# EAGLE schematic pic10_prog_breakout (EAGLE 7.5.0)
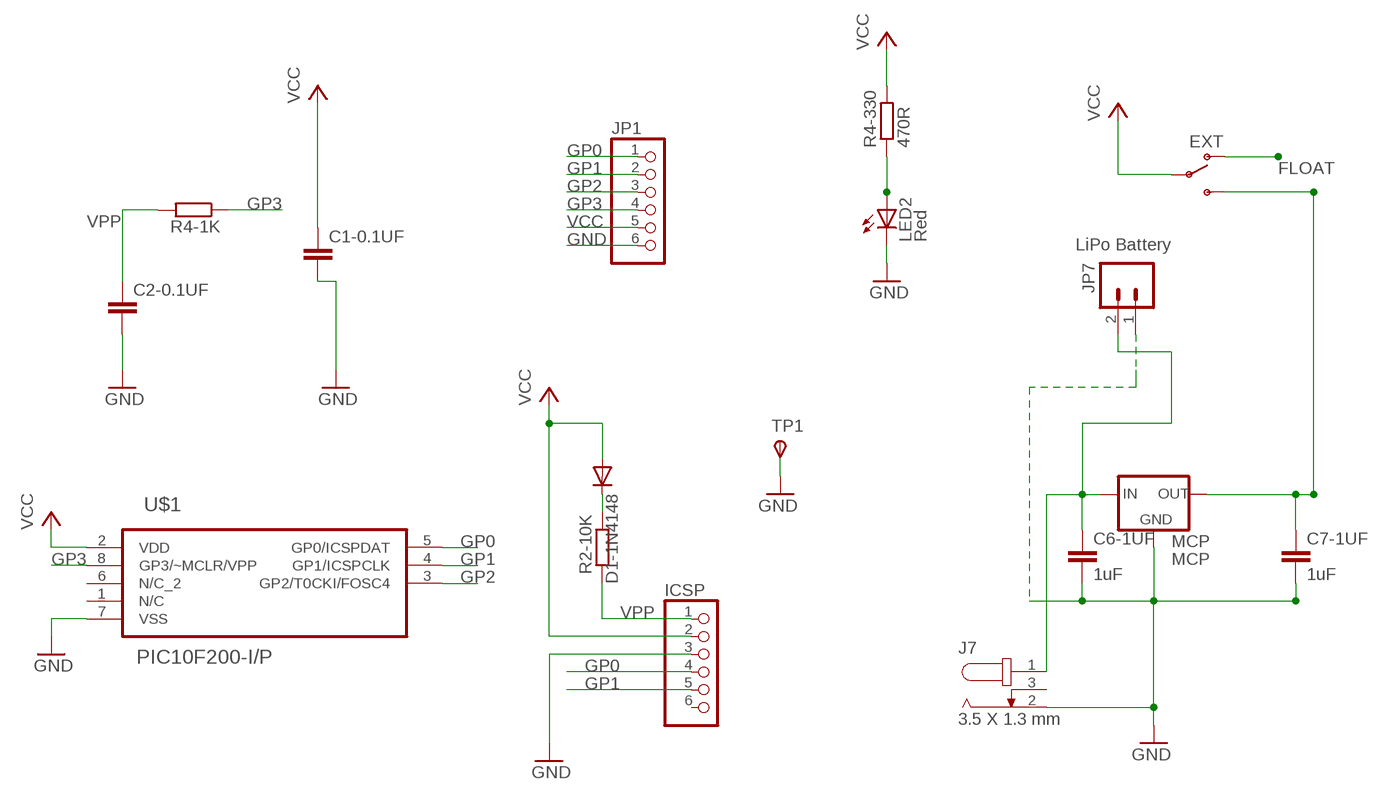
[diagram p0: schematic, sheet 1]

## Parts
C1-0.1UF  C-EU025-025X050  [C025-025X050]
C2-0.1UF  C-EU025-025X050  [C025-025X050]
C6-1UF  1uF  C-EU050-025X075  [C050-025X075]
C7-1UF  1uF  C-EU050-025X075  [C050-025X075]
D1-1N4148  1N4148  1N4148DO35-7  [DO35-7]
ICSP  PINHD-1X6  [1X06]
J7  3.5 X 1.3 mm  DC_JACK_3.5X1.3MM  [3.5X1.3MM_DC_JACK]
JP1  PINHD-1X6  [1X06]
JP7  LiPo Battery  M02JST-PTH-2  [JST-2-PTH]
LED2  Red  LED3MM  [LED3MM]
MCP  MCP  MCP1700TO-92  [TO92-]
ON  EXT  SWITCH-SPSTPTH  [SWITCH-SPDT]
R2-10K  R-EU_0207/10  [0207/10]
R4-1K  R-EU_0207/10  [0207/10]
R4-330  470R  R-EU_0207/10  [0207/10]
TP1  TPSTP20R  [TP20R]
U$1  PIC10F200-I/P  [DIP254P762X533-8]

## Nets
FLOAT: ON.1(O)
GND [GND]: C1-0.1UF.2 C2-0.1UF.2 C6-1UF.2 C7-1UF.2 ICSP.3 J7.2 JP1.6 JP7.1 LED2.K(C) MCP.3(GND) TP1.TP(PP) U$1.7(VSS)
GP0: ICSP.4 JP1.1 U$1.5(GP0/ICSPDAT)
GP1: ICSP.5 JP1.2 U$1.4(GP1/ICSPCLK)
GP2: JP1.3 U$1.3(GP2/T0CKI/FOSC4)
GP3: JP1.4 R4-1K.1 U$1.8(GP3/~MCLR/VPP)
N$1: LED2.A R4-330.1
N$5: D1-1N4148.C R2-10K.2
VCC [VCC]: C1-0.1UF.1 D1-1N4148.A ICSP.2 JP1.5 ON.2(P) R4-330.2 U$1.2(VDD)
VCCEXT [VCC]: C6-1UF.1 J7.1 JP7.2 MCP.2(IN)
VCCREG [VCC]: C7-1UF.1 MCP.1(OUT) ON.3(S)
VPP: C2-0.1UF.1 ICSP.1 R2-10K.1 R4-1K.2
Unconnected: ICSP.6 J7.3 U$1.1(N/C) U$1.6(N/C_2)

## Library data of the parts
C1-0.1UF C2-0.1UF C6-1UF C7-1UF = resistor:C-EU: CAPACITOR, European symbol
D1-1N4148 = diode:1N4148: DIODE high speed (Philips)
ICSP JP1 = pinhead:PINHD-1X6: PIN HEADER
J7 = MY_CONN:DC_JACK_3.5X1.3MM
JP7 = SparkFun:M02: Header 2 Standard 2-pin 0.1" header. Use with straight break away headers (SKU : PRT-00116), right angle break away headers (PRT-00553), swiss pins (PRT-00743), machine pins (PRT-00117), and female headers (PRT-00115). Molex polarized connector foot print use with SKU : PRT-08233 with associated crimp pins and housings.
LED2 = adafruit:LED: LED OSRAM: - CHIPLED LG R971, LG N971, LY N971, LG Q971, LY Q971, LO R971, LY R971 LH N974, LH R974 LS Q976, LO Q976, LY Q976 LO Q996 - Hyper CHIPLED LW Q18S LB Q993, LB Q99A, LB R99A - SideLED LS A670, LO A670, LY A670, LG A670, LP A670 LB A673, LV A673, LT A673, LW A673 LH A674 LY A675 LS A676, LA A676, LO A676, LY A676, LW A676 LS A679, LY A679, LG A679 - Hyper Micro SIDELED® LS Y876, LA Y876, LO Y876, LY Y876 LT Y87S - SmartLED LW L88C, LW L88S LB L89C, LB L89S, LG L890 LS L89K, LO L89K, LY L89K LS L896, LA L896, LO L896, LY L896 - TOPLED LS T670, LO T670, LY T670, LG T670, LP T670 LSG T670, LSP T670, LSY T670, LOP T670, LYG T670 LG T671, LOG T671, LSG T671 LB T673, LV T673, LT T673, LW T673 LH T674 LS T676, LA T676, LO T676, LY T676, LB T676, LH T676, LSB T676, LW T676 LB T67C, LV T67C, LT T67C, LS T67K, LO T67K, LY T67K, LW E67C LS E67B, LA E67B, LO E67B, LY E67B, LB E67C, LV E67C, LT E67C LW T67C LS T679, LY T679, LG T679 LS T770, LO T770, LY T770, LG T770, LP T770 LB T773, LV T773, LT T773, LW T773 LH T774 LS E675, LA E675, LY E675, LS T675 LS T776, LA T776, LO T776, LY T776, LB T776 LHGB T686 LT T68C, LB T68C - Hyper Mini TOPLED® LB M676 - Mini TOPLED Santana® LG M470 LS M47K, LO M47K, LY M47K Source: http://www.osram.convergy.de/
MCP = MY_IC:MCP1700
ON = SparkFun:SWITCH-SPST: SPST Switch Simple slide switch. Spark Fun Electronics SKU : COM-00102
R2-10K R4-1K R4-330 = resistor:R-EU_: RESISTOR, European symbol
TP1 = testpad:TPS: TEST PIN
U$1 = thierry_eagle:PIC10F200-I/P: Microcontrollers; MPN: PIC10F200-I/P; OC_FARNELL: 1212714; OC_NEWARK: 96K3749; PACKAGE: DIP-8; SUPPLIER: Microchip

## Net classes
0 default: width 0.508 mm
1 GND: width 0.889 mm, drill 0.508 mm, clearance 0.254 mm
2 VCC: width 0.889 mm, drill 0.508 mm, clearance 0.254 mm